# Altium schematic sheet dual-ecal-RF-board.SchDoc
size A; SheetNumber: 1; SheetTotal: 1
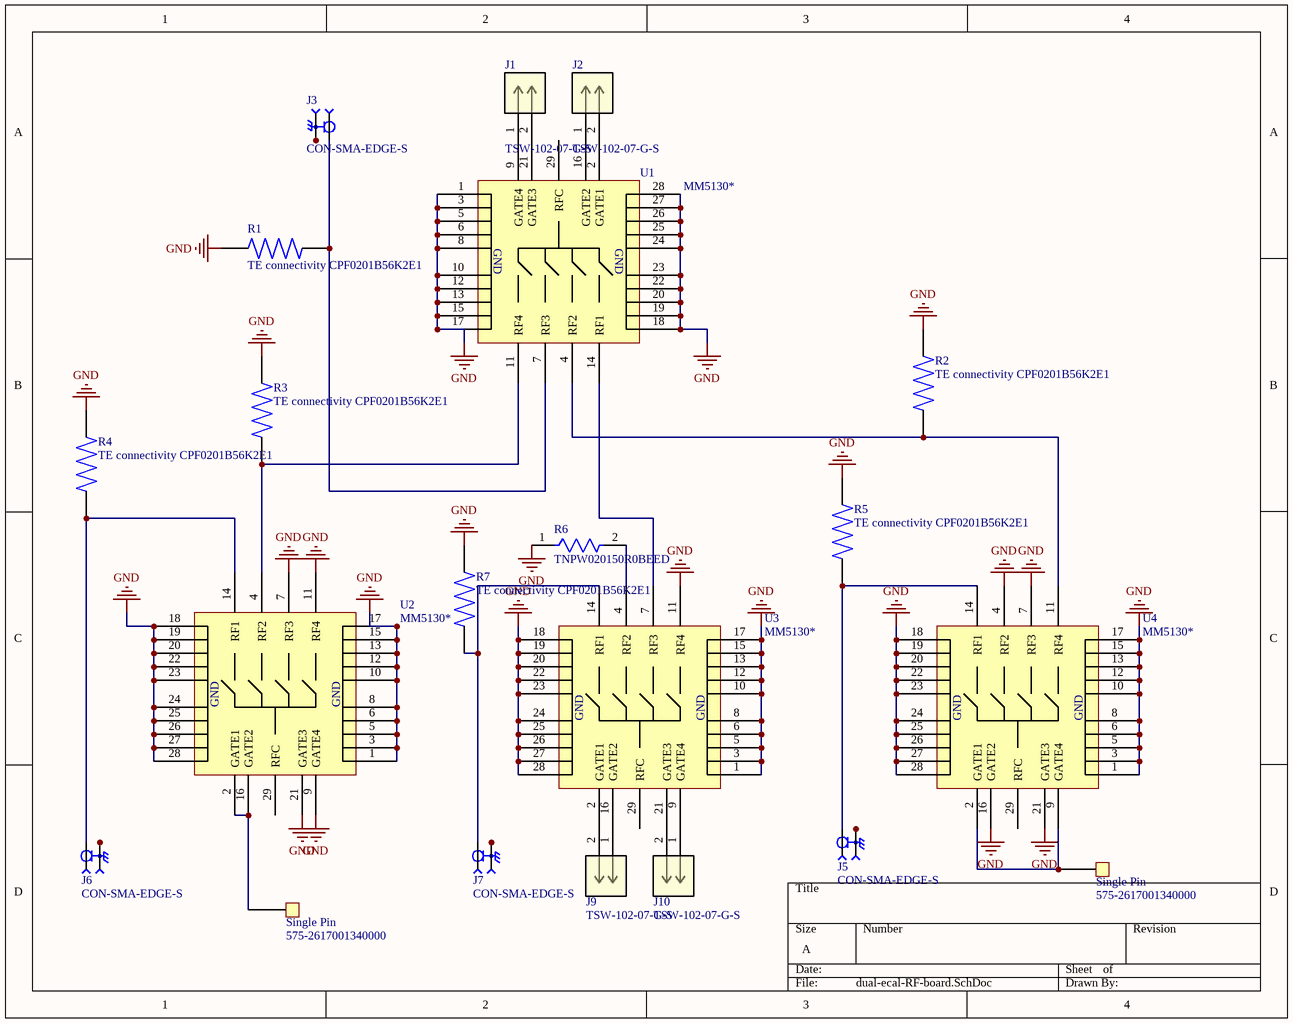
[diagram p0: dual-ecal-RF-board.SchDoc]

## Parts
J1  TSW-102-07-G-S  [TSW-102-07-G-S-iceberg]
J2  TSW-102-07-G-S  [TSW-102-07-G-S-iceberg]
J3  CON-SMA-EDGE-S  [RFSOLUTIONS_CON-SMA-EDGE-S]
J4  Single Pin  Supplier Part Number 1: 575-2617001340000  [Single PC Pin]
J5  CON-SMA-EDGE-S  [RFSOLUTIONS_CON-SMA-EDGE-S]
J6  CON-SMA-EDGE-S  [RFSOLUTIONS_CON-SMA-EDGE-S]
J7  CON-SMA-EDGE-S  [RFSOLUTIONS_CON-SMA-EDGE-S]
J8  Single Pin  Supplier Part Number 1: 575-2617001340000  [Single PC Pin]
J9  TSW-102-07-G-S  [TSW-102-07-G-S-iceberg]
J10  TSW-102-07-G-S  [TSW-102-07-G-S-iceberg]
R1  TE connectivity CPF0201B56K2E1  [0201-resistor]
R2  TE connectivity CPF0201B56K2E1  [0201-resistor]
R3  TE connectivity CPF0201B56K2E1  [0201-resistor]
R4  TE connectivity CPF0201B56K2E1  [0201-resistor]
R5  TE connectivity CPF0201B56K2E1  [0201-resistor]
R6  TNPW020150R0BEED  [FP-ERJ1GN-IPC_C]
R7  TE connectivity CPF0201B56K2E1  [0201-resistor]
U1  MM5130*  [MM5130-NORM_PCB_NOFLOOD]
U2  MM5130*  [MM5130-NORM_PCB_NOFLOOD]
U3  MM5130*  [MM5130-NORM_PCB_NOFLOOD]
U4  MM5130*  [MM5130-NORM_PCB_NOFLOOD]

## Nets
GND: R1.1 R2.1 R3.1 R4.1 R5.1 R6.1 R7.1 U1.1(GND) U1.3(GND) U1.5(GND) U1.6(GND) U1.8(GND) U1.10(GND) U1.12(GND) U1.13(GND) U1.15(GND) U1.17(GND) U1.18(GND) U1.19(GND) U1.20(GND) U1.22(GND) U1.23(GND) U1.24(GND) U1.25(GND) U1.26(GND) U1.27(GND) U1.28(GND) U2.1(GND) U2.3(GND) U2.5(GND) U2.6(GND) U2.7(RF3) U2.8(GND) U2.9(GATE4) U2.10(GND) U2.11(RF4) U2.12(GND) U2.13(GND) U2.15(GND) U2.17(GND) U2.18(GND) U2.19(GND) U2.20(GND) U2.21(GATE3) U2.22(GND) U2.23(GND) U2.24(GND) U2.25(GND) U2.26(GND) U2.27(GND) U2.28(GND) U3.1(GND) U3.3(GND) U3.5(GND) U3.6(GND) U3.8(GND) U3.10(GND) U3.11(RF4) U3.12(GND) U3.13(GND) U3.15(GND) U3.17(GND) U3.18(GND) U3.19(GND) U3.20(GND) U3.22(GND) U3.23(GND) U3.24(GND) U3.25(GND) U3.26(GND) U3.27(GND) U3.28(GND) U4.1(GND) U4.3(GND) U4.4(RF2) U4.5(GND) U4.6(GND) U4.7(RF3) U4.8(GND) U4.10(GND) U4.12(GND) U4.13(GND) U4.15(GND) U4.16(GATE2) U4.17(GND) U4.18(GND) U4.19(GND) U4.20(GND) U4.21(GATE3) U4.22(GND) U4.23(GND) U4.24(GND) U4.25(GND) U4.26(GND) U4.27(GND) U4.28(GND)
NetJ1_1: J1.1 U1.9(GATE4)
NetJ1_2: J1.2 U1.21(GATE3)
NetJ2_1: J2.1 U1.16(GATE2)
NetJ2_2: J2.2 U1.2(GATE1)
NetJ3_1: J3.1 R1.2 U1.7(RF3)
NetJ3_G1: J3.G1 J3.G2 J3.G3 J3.G4
NetJ4_1: J4.1 U4.2(GATE1) U4.9(GATE4)
NetJ5_1: J5.1 R5.2 U4.14(RF1)
NetJ5_G1: J5.G1 J5.G2 J5.G3 J5.G4
NetJ6_1: J6.1 R4.2 U2.14(RF1)
NetJ6_G1: J6.G1 J6.G2 J6.G3 J6.G4
NetJ7_1: J7.1 R7.2 U3.14(RF1)
NetJ7_G1: J7.G1 J7.G2 J7.G3 J7.G4
NetJ8_1: J8.1 U2.2(GATE1) U2.16(GATE2)
NetJ9_1: J9.1 U3.16(GATE2)
NetJ9_2: J9.2 U3.2(GATE1)
NetJ10_1: J10.1 U3.9(GATE4)
NetJ10_2: J10.2 U3.21(GATE3)
NetR2_2: R2.2 U1.4(RF2) U4.11(RF4)
NetR3_2: R3.2 U1.11(RF4) U2.4(RF2)
NetR6_2: R6.2 U3.4(RF2)
NetU1_14: U1.14(RF1) U3.7(RF3)

Not connected (* = marked no-connect by the designer): U1 29(RFC); U2 29(RFC); U3 29(RFC); U4 29(RFC)

## Library data of the parts
J1 J2 J9 J10 = TSW-102-07-G-S-iceberg: No Description Available; Mfr_Name: Samtec Inc; Copyright: Copyright (C) 2024 Ultra Librarian. All rights reserved.; Manufacturer_Part_Number: TSW-102-07-G-S; RefDes: RefDes; Type: DEV
J3 J5-J7 = CON-SMA-EDGE-S: SMA Connector Jack, Female Socket - Board Edge, End Launch Solder; MF: RF Solutions; Value: *; SnapEDA_Link: https://www.snapeda.com/parts/CON-SMA-EDGE-S/RF+Solutions/view-part/?ref=snap; Purchase-URL: https://pricing.snapeda.com/search/part/CON-SMA-EDGE-S/?ref=eda; Check_prices: https://www.snapeda.com/parts/CON-SMA-EDGE-S/RF+Solutions/view-part/?ref=eda; Digi-Key_Part_Number: CON-SMA-EDGE-S-ND; Package: None; MP: CON-SMA-EDGE-S
J4 J8 = Single PC Pin: Supplier 1: Mouser
R1-R5 R7 = TE connectivity CPF0201B56K2E1: CPF 0201 56K2 0.1% 25PPM 1K RL; MP: ERJ1GN0R00C; Value: 56k; Availability: Unavailable; Price: None; Package: None; Mfgr: TE connectivity; Mfgr Part No.: CPF0201B56K2E1
R6 = CMP-1010-00416-3: RES SMD 50 OHM 0.1% 1/20W 0201; Temperature Coefficient: 200ppm/°C; Resistance Tolerance: 1%; Max Power Dissipation: 50mW; Voltage Rating (DC): 25V; Resistance: 1kR; Number of Pins: 2; Height: 0.01inch; Weight: 6E-06oz; Min Operating Temperature: -55°C; Features: Automotive AEC-Q200; Radiation Hardening: No; Resistor Type: Thick Film; RoHS Compliant: Yes; Termination: SMD/SMT; Package Quantity: 15000; Size Code: 0201; Case Code (Imperial): 0201; Contact Plating: Tin; Case/Package: 0201; Lead Free: Lead Free; Number of Terminations: 2; Tolerance: 1%; Max Operating Temperature: 125°C; Mount: Surface Mount; Width: 0.012inch; Series: ERJ; Voltage Rating: 25V; Power Rating: 50mW; Packaging: Tape and Reel; Length: 0.6mm; Case Code (Metric): 0603
U1-U4 = IC-MM5130: High power SP4T MEMs switch